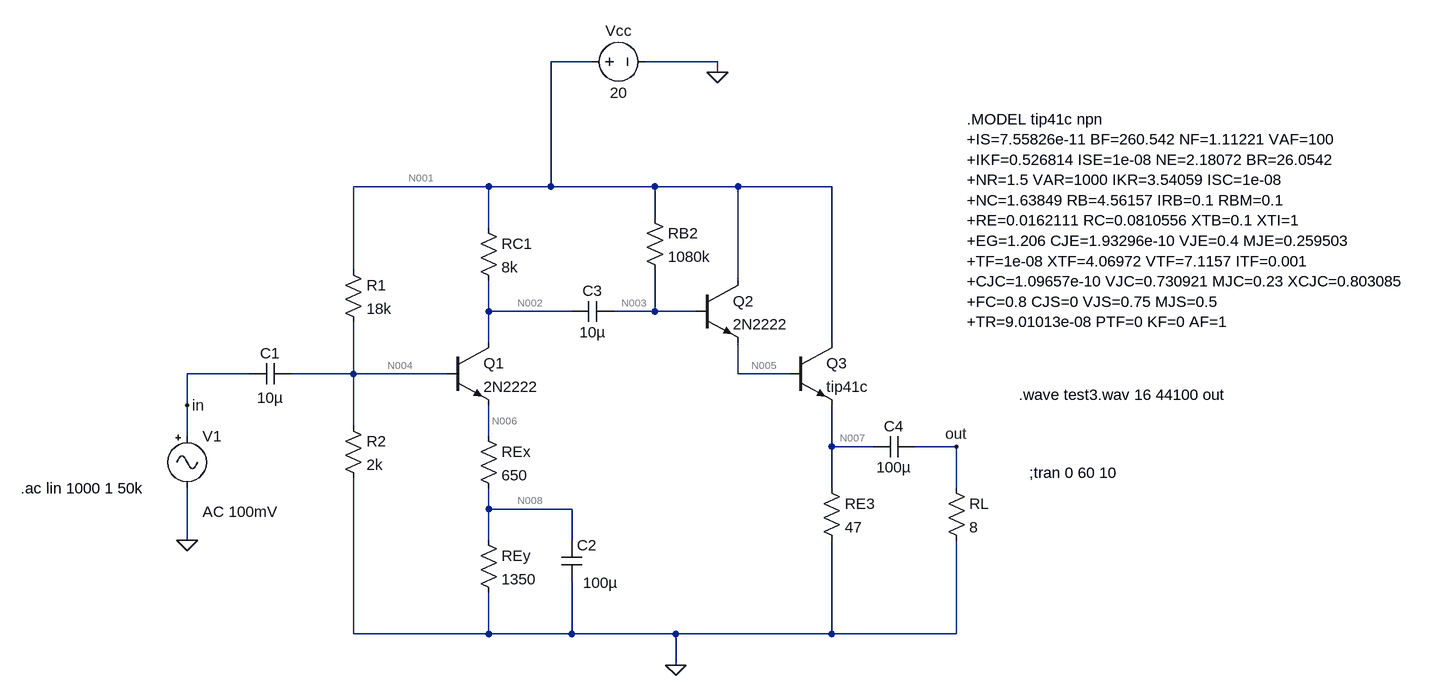
[diagram p0: schematic BTL.asc]
BTL.asc, the LTspice schematic file:
Version 4
SHEET 1 1508 680
WIRE 208 -336 144 -336
WIRE 400 -336 288 -336
WIRE 400 -320 400 -336
WIRE 48 -144 -160 -144
WIRE 144 -144 144 -336
WIRE 144 -144 48 -144
WIRE 304 -144 144 -144
WIRE 432 -144 304 -144
WIRE 576 -144 432 -144
WIRE 304 -96 304 -144
WIRE 48 -80 48 -144
WIRE -160 -16 -160 -144
WIRE 432 0 432 -144
WIRE 48 48 48 0
WIRE 176 48 48 48
WIRE 304 48 304 -16
WIRE 304 48 240 48
WIRE 368 48 304 48
WIRE 48 96 48 48
WIRE 576 96 576 -144
WIRE -320 144 -416 144
WIRE -160 144 -160 64
WIRE -160 144 -256 144
WIRE -16 144 -160 144
WIRE 432 144 432 96
WIRE 512 144 432 144
WIRE -416 192 -416 144
WIRE -160 224 -160 144
WIRE -416 240 -416 192
WIRE 48 240 48 192
WIRE 576 256 576 192
WIRE 640 256 576 256
WIRE 768 256 704 256
WIRE 576 320 576 256
WIRE 768 320 768 256
WIRE 48 352 48 320
WIRE 176 352 48 352
WIRE -416 400 -416 320
WIRE 48 400 48 352
WIRE 176 400 176 352
WIRE -160 544 -160 304
WIRE 48 544 48 480
WIRE 48 544 -160 544
WIRE 176 544 176 464
WIRE 176 544 48 544
WIRE 336 544 176 544
WIRE 576 544 576 400
WIRE 576 544 336 544
WIRE 768 544 768 400
WIRE 768 544 576 544
WIRE 336 592 336 544
FLAG 336 592 0
FLAG 400 -320 0
FLAG -416 400 0
FLAG -416 192 in
FLAG 768 256 out
SYMBOL voltage 192 -336 R270
WINDOW 0 32 56 VTop 2
WINDOW 3 -32 56 VBottom 2
WINDOW 123 0 0 Left 0
WINDOW 39 0 0 Left 0
SYMATTR InstName Vcc
SYMATTR Value 20
SYMBOL res -176 -32 R0
SYMATTR InstName R1
SYMATTR Value 18k
SYMBOL res -176 208 R0
SYMATTR InstName R2
SYMATTR Value 2k
SYMBOL res 32 -96 R0
SYMATTR InstName RC1
SYMATTR Value 8k
SYMBOL res 32 224 R0
SYMATTR InstName REx
SYMATTR Value 650
SYMBOL res 288 -112 R0
SYMATTR InstName RB2
SYMATTR Value 1080k
SYMBOL res 560 304 R0
SYMATTR InstName RE3
SYMATTR Value 47
SYMBOL res 752 304 R0
SYMATTR InstName RL
SYMATTR Value 8
SYMBOL res 32 384 R0
SYMATTR InstName REy
SYMATTR Value 1350
SYMBOL cap -256 128 R90
WINDOW 0 0 32 VBottom 2
WINDOW 3 37 32 VTop 2
SYMATTR InstName C1
SYMATTR Value 10µ
SYMBOL cap 160 400 R0
WINDOW 3 33 65 Left 2
SYMATTR Value 100µ
SYMATTR InstName C2
SYMBOL cap 240 32 R90
WINDOW 0 0 32 VBottom 2
WINDOW 3 32 32 VTop 2
SYMATTR InstName C3
SYMATTR Value 10µ
SYMBOL cap 704 240 R90
WINDOW 0 0 32 VBottom 2
WINDOW 3 32 32 VTop 2
SYMATTR InstName C4
SYMATTR Value 100µ
SYMBOL npn -16 96 R0
SYMATTR InstName Q1
SYMATTR Value 2N2222
SYMBOL npn 368 0 R0
SYMATTR InstName Q2
SYMATTR Value 2N2222
SYMBOL npn 512 96 R0
SYMATTR InstName Q3
SYMATTR Value tip41c
SYMBOL Misc\\signal -416 224 R0
WINDOW 123 24 132 Left 2
WINDOW 39 0 0 Left 0
SYMATTR Value2 AC 100mV
SYMATTR InstName V1
SYMATTR Value ""
TEXT 784 -248 Left 2 !.MODEL tip41c npn\n+IS=7.55826e-11 BF=260.542 NF=1.11221 VAF=100\n+IKF=0.526814 ISE=1e-08 NE=2.18072 BR=26.0542\n+NR=1.5 VAR=1000 IKR=3.54059 ISC=1e-08\n+NC=1.63849 RB=4.56157 IRB=0.1 RBM=0.1\n+RE=0.0162111 RC=0.0810556 XTB=0.1 XTI=1\n+EG=1.206 CJE=1.93296e-10 VJE=0.4 MJE=0.259503\n+TF=1e-08 XTF=4.06972 VTF=7.1157 ITF=0.001\n+CJC=1.09657e-10 VJC=0.730921 MJC=0.23 XCJC=0.803085\n+FC=0.8 CJS=0 VJS=0.75 MJS=0.5\n+TR=9.01013e-08 PTF=0 KF=0 AF=1
TEXT 864 176 Left 2 !.wave test3.wav 16 44100 out
TEXT 880 296 Left 2 !;tran 0 60 10
TEXT -672 320 Left 2 !.ac lin 1000 1 50k

The netlist it stands for:
* BTL.asc
Vcc N001 0 20
R1 N001 N004 18k
R2 N004 0 2k
RC1 N001 N002 8k
REx N006 N008 650
RB2 N001 N003 1080k
RE3 N007 0 47
RL out 0 8
REy N008 0 1350
C1 N004 in 10µ
C2 N008 0 100µ
C3 N003 N002 10µ
C4 out N007 100µ
Q1 N002 N004 N006 0 2N2222
Q2 N001 N003 N005 0 2N2222
Q3 N001 N005 N007 0 tip41c
V1 in 0 AC 100mV
.model NPN NPN
.model PNP PNP
.lib standard.bjt
.MODEL tip41c npn
+IS=7.55826e-11 BF=260.542 NF=1.11221 VAF=100
+IKF=0.526814 ISE=1e-08 NE=2.18072 BR=26.0542
+NR=1.5 VAR=1000 IKR=3.54059 ISC=1e-08
+NC=1.63849 RB=4.56157 IRB=0.1 RBM=0.1
+RE=0.0162111 RC=0.0810556 XTB=0.1 XTI=1
+EG=1.206 CJE=1.93296e-10 VJE=0.4 MJE=0.259503
+TF=1e-08 XTF=4.06972 VTF=7.1157 ITF=0.001
+CJC=1.09657e-10 VJC=0.730921 MJC=0.23 XCJC=0.803085
+FC=0.8 CJS=0 VJS=0.75 MJS=0.5
+TR=9.01013e-08 PTF=0 KF=0 AF=1
.wave test3.wav 16 44100 out
;tran 0 60 10
.ac lin 1000 1 50k
.backanno
.end

* Results of the author's LTspice run, read from the files saved beside the schematic
* Operating Point, zero values left out:
*   V(n001) = 20 V
*   V(n004) = 1.995 V
*   V(n002) = 14.61 V
*   V(n006) = 1.353 V
*   V(n008) = 913 mV
*   V(n003) = 11.31 V
*   V(n007) = 9.996 V
*   V(n005) = 10.64 V
*   Ic(Q3) = 210.9 mA
*   Ib(Q3) = 1.748 mA
*   Ie(Q3) = -212.7 mA
*   Ic(Q2) = 1.74 mA
*   Ib(Q2) = 8.049 µA
*   Ie(Q2) = -1.748 mA
*   Ic(Q1) = 673.3 µA
*   Ib(Q1) = 2.995 µA
*   Ie(Q1) = -676.3 µA
*   I(Rey) = 676.3 µA
*   I(Re3) = 212.7 mA
*   I(Rb2) = 8.049 µA
*   I(Rex) = 676.3 µA
*   I(Rc1) = 673.3 µA
*   I(R2) = 997.3 µA
*   I(R1) = 1 mA
*   I(Vcc) = -214.4 mA